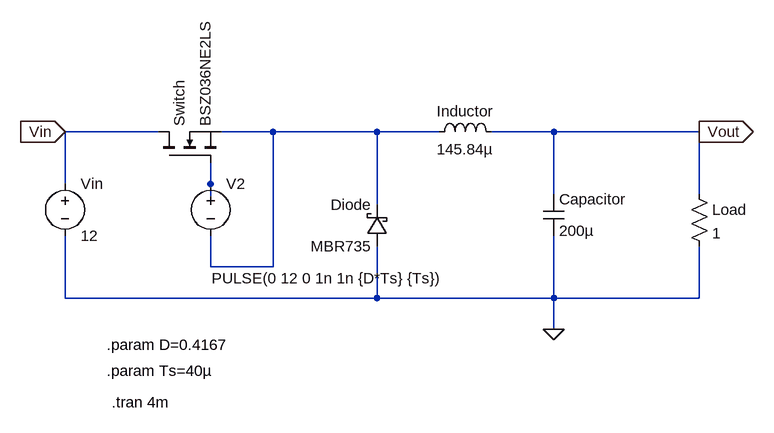
[diagram p0: schematic buck_converter2.asc]
buck_converter2.asc, the LTspice schematic file:
Version 4
SHEET 1 1008 680
WIRE 64 80 -80 80
WIRE 240 80 160 80
WIRE 400 80 240 80
WIRE 496 80 400 80
WIRE 672 80 576 80
WIRE 896 80 672 80
WIRE -80 160 -80 80
WIRE 144 160 144 128
WIRE 672 176 672 80
WIRE 896 176 896 80
WIRE 144 192 144 160
WIRE 400 192 400 80
WIRE 144 288 144 240
WIRE 240 288 240 80
WIRE 240 288 144 288
WIRE -80 336 -80 240
WIRE 400 336 400 256
WIRE 400 336 -80 336
WIRE 672 336 672 240
WIRE 672 336 400 336
WIRE 896 336 896 256
WIRE 896 336 672 336
WIRE 672 384 672 336
FLAG 672 384 0
FLAG -80 80 Vin
IOPIN -80 80 In
FLAG 896 80 Vout
IOPIN 896 80 Out
SYMBOL voltage -80 144 R0
WINDOW 123 0 0 Left 0
WINDOW 39 0 0 Left 0
SYMATTR InstName Vin
SYMATTR Value 12
SYMBOL nmos 64 128 R270
SYMATTR InstName Switch
SYMATTR Value BSZ036NE2LS
SYMBOL voltage 144 144 R0
WINDOW 3 2 161 Left 2
WINDOW 123 0 0 Left 0
WINDOW 39 0 0 Left 0
SYMATTR InstName V2
SYMATTR Value PULSE(0 12 0 1n 1n {D*Ts} {Ts})
SYMBOL schottky 416 256 R180
WINDOW 0 24 64 Left 2
WINDOW 3 24 0 Left 2
SYMATTR InstName Diode
SYMATTR Value MBR735
SYMATTR Description Diode
SYMATTR Type diode
SYMBOL ind 480 96 R270
WINDOW 0 32 56 VTop 2
WINDOW 3 5 56 VBottom 2
SYMATTR InstName Inductor
SYMATTR Value 145.84µ
SYMATTR SpiceLine Rser=10m
SYMBOL cap 656 176 R0
SYMATTR InstName Capacitor
SYMATTR Value 200µ
SYMBOL res 880 160 R0
SYMATTR InstName Load
SYMATTR Value 1
TEXT -16 408 Left 2 !.param D=0.4167
TEXT -16 448 Left 2 !.param Ts=40µ
TEXT -8 496 Left 2 !.tran 4m

The netlist it stands for:
* buck_converter2.asc
Vin Vin 0 12
M§Switch Vin N002 N001 N001 BSZ036NE2LS
V2 N002 N001 PULSE(0 12 0 1n 1n {D*Ts} {Ts})
Diode 0 N001 MBR735
L§Inductor N001 Vout 145.84µ Rser=10m
Capacitor Vout 0 200µ
R§Load Vout 0 1
.model D D
.lib standard.dio
.model NMOS NMOS
.model PMOS PMOS
.lib standard.mos
.param D=0.4167
.param Ts=40µ
.tran 4m
.backanno
.end